# Altium schematic sheet Sheet2.SchDoc
size 558 x 431 mm; SheetNumber: 2; SheetTotal: 2
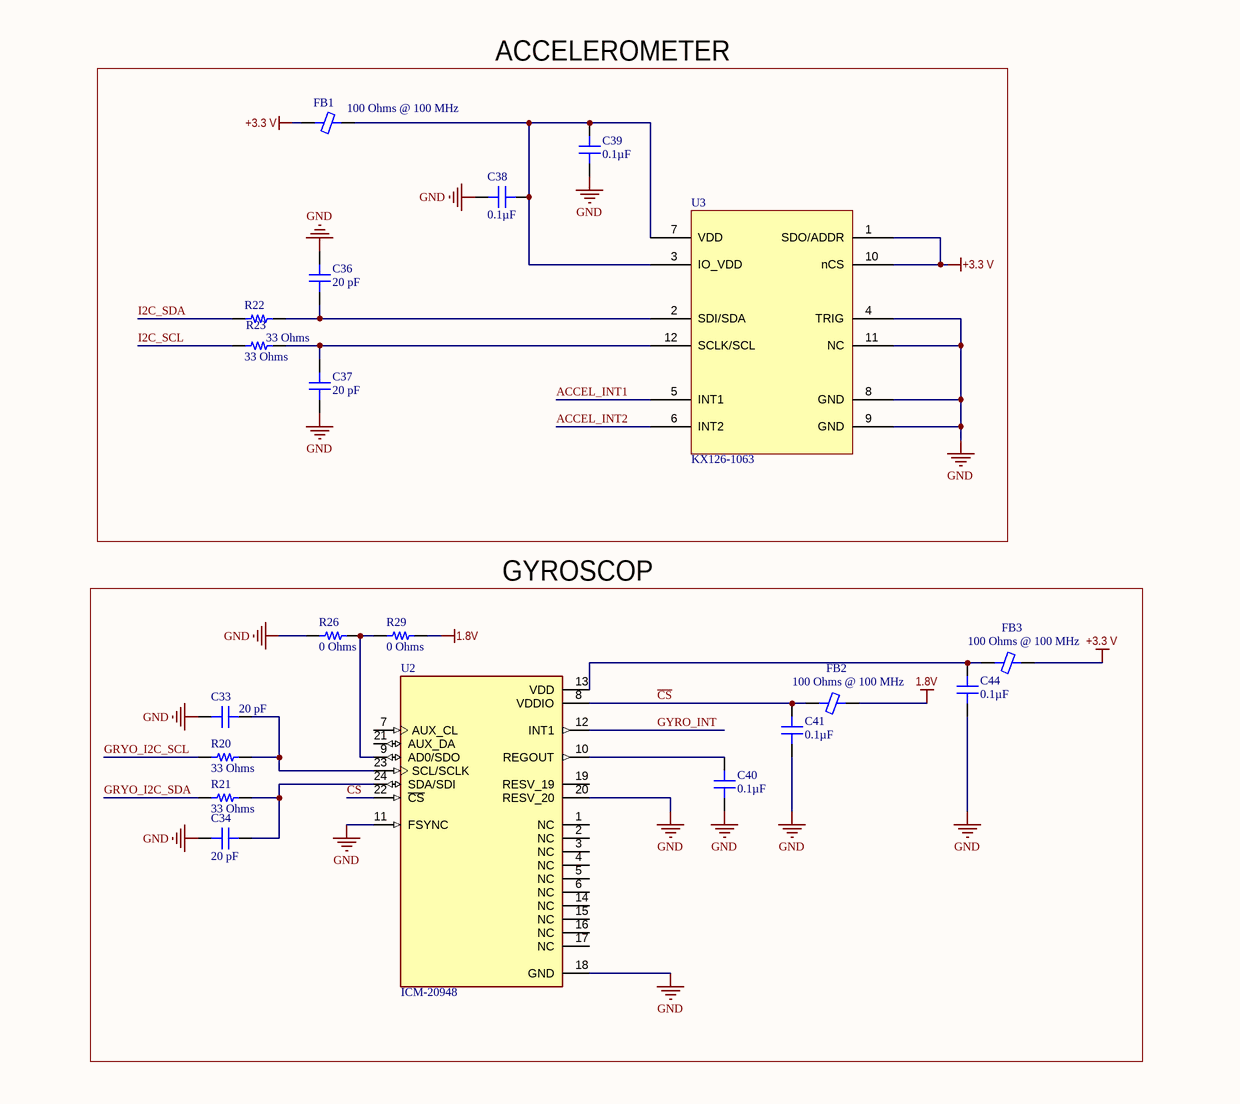
[diagram p0: Sheet2.SchDoc, top left]
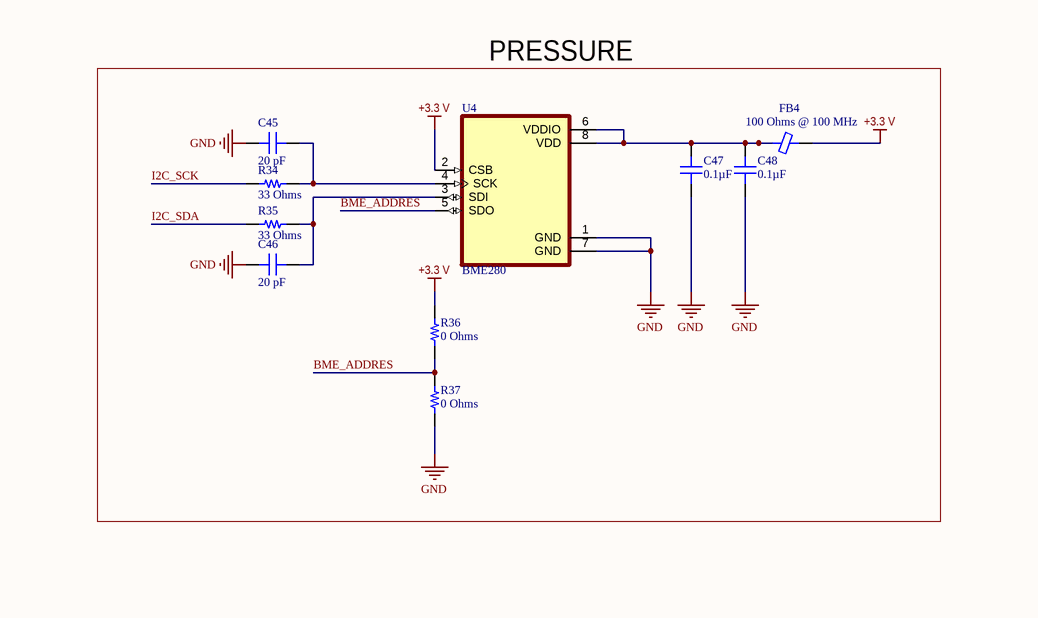
[diagram p1: Sheet2.SchDoc, top right]
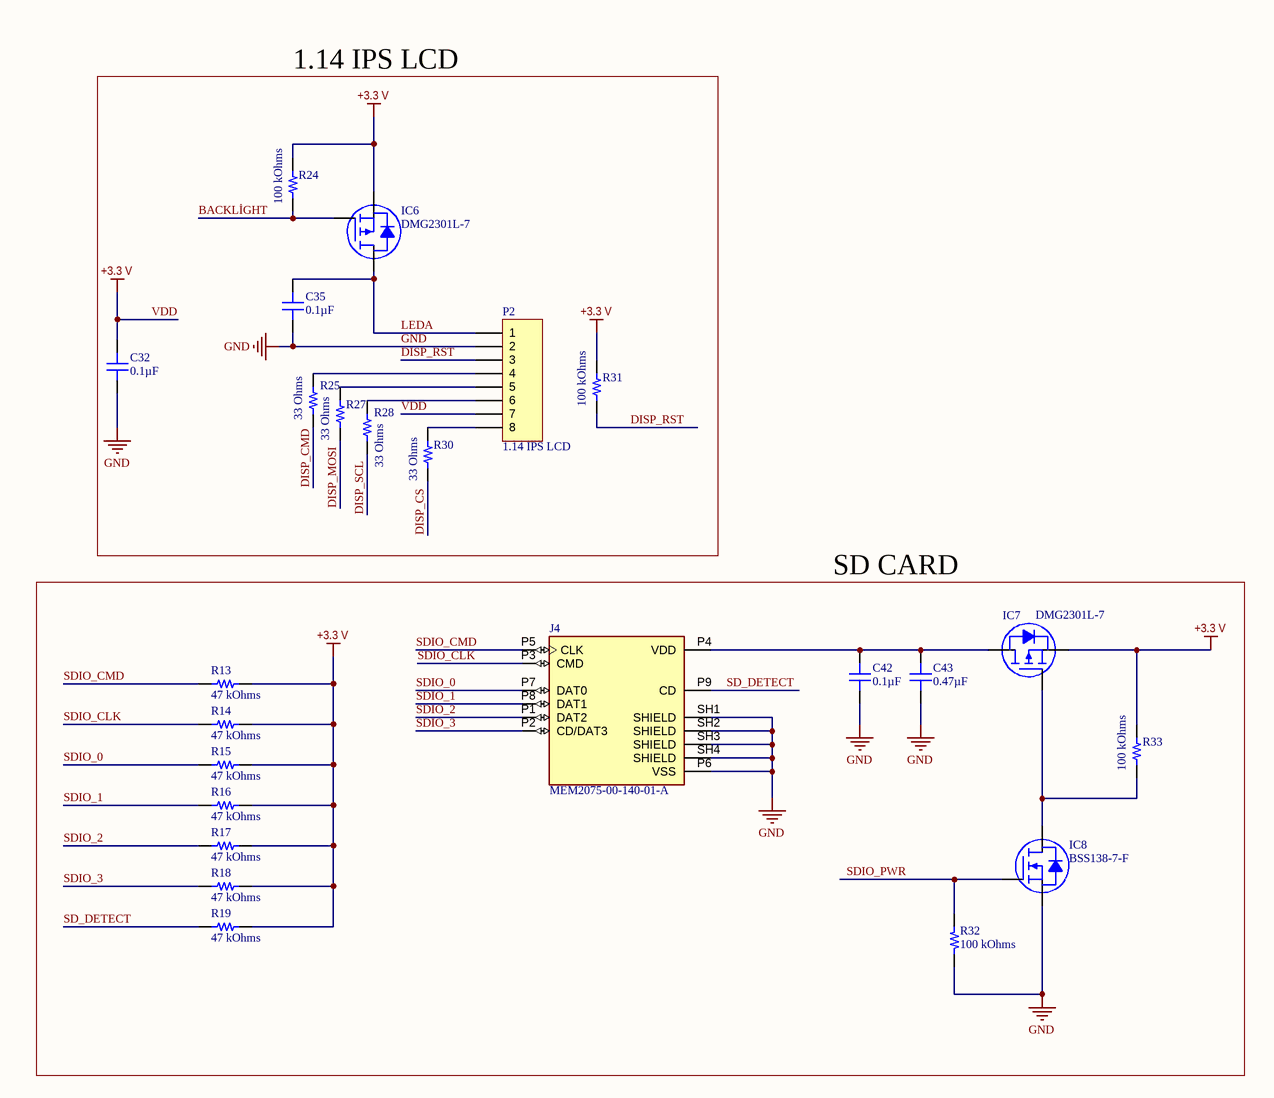
[diagram p2: Sheet2.SchDoc, bottom left]
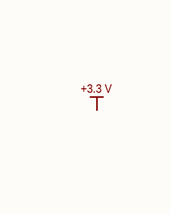
[diagram p3: Sheet2.SchDoc, bottom right]

## Parts
C32  0.1µF  [CAP 0603_1608]
C33  20 pF  [CAP 0603_1608]
C34  20 pF  [CAP 0603_1608]
C35  0.1µF  [CAP 0603_1608]
C36  20 pF  [CAP 0603_1608]
C37  20 pF  [CAP 0603_1608]
C38  0.1µF  [CAP 0603_1608]
C39  0.1µF  [CAP 0603_1608]
C40  0.1µF  [CAP 0603_1608]
C41  0.1µF  [CAP 0603_1608]
C42  0.1µF  [CAP 0603_1608]
C43  0.47µF  [CAP 0603_1608]
C44  0.1µF  [CAP 0603_1608]
C45  20 pF  [CAP 0603_1608]
C46  20 pF  [CAP 0603_1608]
C47  0.1µF  [CAP 0603_1608]
C48  0.1µF  [CAP 0603_1608]
FB1  100 Ohms @ 100 MHz  [FER 0603_1608]
FB2  100 Ohms @ 100 MHz  [FER 0603_1608]
FB3  100 Ohms @ 100 MHz  [FER 0603_1608]
FB4  100 Ohms @ 100 MHz  [FER 0603_1608]
IC6  DMG2301L-7  [DIODES SOT-23-3]
IC7  DMG2301L-7  [DIODES SOT-23-3]
IC8  BSS138-7-F  [DIODES SOT-23-3]
J4  MEM2075-00-140-01-A  [GCT_MEM2075-00-140-01-A]
P2  1.14 IPS LCD  [HIROSE_FH52-8S-0.5SH(99)]
R13  47 kOhms  [RES 0603_1608]
R14  47 kOhms  [RES 0603_1608]
R15  47 kOhms  [RES 0603_1608]
R16  47 kOhms  [RES 0603_1608]
R17  47 kOhms  [RES 0603_1608]
R18  47 kOhms  [RES 0603_1608]
R19  47 kOhms  [RES 0603_1608]
R20  33 Ohms  [RES 0603_1608]
R21  33 Ohms  [RES 0603_1608]
R22  33 Ohms  [RES 0603_1608]
R23  33 Ohms  [RES 0603_1608]
R24  100 kOhms  [RES 0603_1608]
R25  33 Ohms  [RES 0603_1608]
R26  0 Ohms  [RES 0603_1608]
R27  33 Ohms  [RES 0603_1608]
R28  33 Ohms  [RES 0603_1608]
R29  0 Ohms  [RES 0603_1608]
R30  33 Ohms  [RES 0603_1608]
R31  100 kOhms  [RES 0603_1608]
R32  100 kOhms  [RES 0603_1608]
R33  100 kOhms  [RES 0603_1608]
R34  33 Ohms  [RES 0603_1608]
R35  33 Ohms  [RES 0603_1608]
R36  0 Ohms  [RES 0603_1608]
R37  0 Ohms  [RES 0603_1608]
U2  ICM-20948  [QFN40P300X300X105-24N]
U3  KX126-1063  [KIONIX_KXTJ3-1057]
U4  BME280  [PSON65P250X250X100-8N]

## Blocks framed on the sheet
ACCELEROMETER: C36-C39 FB1 R22 R23 U3
PRESSURE: C45-C48 FB4 R34-R37 U4
GYROSCOP: C33 C34 C40 C41 C44 FB2 FB3 R20 R21 R26 R29 U2
1.14 IPS LCD: C32 C35 IC6 P2 R24 R25 R27 R28 R30 R31
SD CARD: C42 C43 IC7 IC8 J4 R13-R19 R32 R33

## Nets
1.8V: FB2.2 R29.2
GND: C32.1 C33.1 C34.2 C35.1 C36.1 C37.2 C38.2 C39.1 C40.1 C41.1 C42.1 C43.1 C44.1 C45.1 C46.2 C47.1 C48.1 IC8.2(S) J4.P6(VSS) J4.SH1(SHIELD) J4.SH2(SHIELD) J4.SH3(SHIELD) J4.SH4(SHIELD) P2.2 R26.1 R32.1 R37.1 U2.11(FSYNC) U2.18(GND) U2.20(RESV_20) U3.4(TRIG) U3.8(GND) U3.9(GND) U3.11(NC) U4.1(GND) U4.7(GND)
VDD: C32.2 FB1.2 FB3.2 FB4.2 IC6.2(S) IC7.2(S) P2.7 R13.2 R14.2 R15.2 R16.2 R17.2 R18.2 R19.2 R24.2 R31.2 R33.2 R36.2 U3.1(SDO/ADDR) U3.10(nCS) U4.2(CSB)  [also labelled +3.3 V]
ACCEL_INT1: U3.5(INT1)
ACCEL_INT2: U3.6(INT2)
BACKLİGHT: IC6.1(G) R24.1
BME_ADDRES: R36.1 R37.2 U4.5(SDO)
~{CS}: C41.2 FB2.1 U2.8(VDDIO) U2.22(~{CS})
DISP_CMD: R25.2
DISP_CS: R30.1
DISP_MOSI: R27.1
DISP_RST: P2.3 R31.1
DISP_SCL: R28.1
GRYO_I2C_SCL: R20.1
GRYO_I2C_SDA: R21.1
GYRO_INT: U2.12(INT1)
I2C_SCK: R34.2
I2C_SCL: R23.1
I2C_SDA: R22.1 R35.1
LEDA: C35.2 IC6.3(D) P2.1
SD_DETECT: J4.P9(CD) R19.1
SDIO_0: J4.P7(DAT0) R15.1
SDIO_1: J4.P8(DAT1) R16.1
SDIO_2: J4.P1(DAT2) R17.1
SDIO_3: J4.P2(CD/DAT3) R18.1
SDIO_CLK: J4.P3(CMD) R14.1
SDIO_CMD: J4.P5(CLK) R13.1
SDIO_PWR: IC8.1(G) R32.2
NetC33_2: C33.2 R20.2 U2.23(SCL/SCLK)
NetC34_1: C34.1 R21.2 U2.24(SDA/SDI)
NetC36_2: C36.2 R22.2 U3.2(SDI/SDA)
NetC37_1: C37.1 R23.2 U3.12(SCLK/SCL)
NetC38_1: C38.1 C39.2 FB1.1 U3.3(IO_VDD) U3.7(VDD)
NetC40_2: C40.2 U2.10(REGOUT)
NetC42_2: C42.2 C43.2 IC7.3(D) J4.P4(VDD)
NetC44_2: C44.2 FB3.1 U2.13(VDD)
NetC45_2: C45.2 R34.1 U4.4(SCK)
NetC46_1: C46.1 R35.2 U4.3(SDI)
NetC47_2: C47.2 C48.2 FB4.1 U4.6(VDDIO) U4.8(VDD)
NetIC7_1: IC7.1(G) IC8.3(D) R33.1
NetP2_4: P2.4 R25.1
NetP2_5: P2.5 R27.2
NetP2_6: P2.6 R28.2
NetP2_8: P2.8 R30.2
NetR26_2: R26.2 R29.1 U2.9(AD0/SDO)

Not connected (* = marked no-connect by the designer): U2 1(NC) 2(NC) 3(NC) 4(NC) 5(NC) 6(NC) 7(AUX_CL) 14(NC) 15(NC) 16(NC) 17(NC) 19(RESV_19) 21(AUX_DA)

## Notes on the sheet
- Labels drawn without touching a wire or pin: +3.3 V
- DWG. NO.
- REV.
- SHT.
- REVISION
- DESCRIPTION
- DATE
- APPROVED
- THIS DOCUMENT AND THE DATA DISCLOSED HEREIN OR HEREWITH IS THE PROPERTY OF ALTIUM LIMITED AND MAY BE FREELY DISTRIBUTED IN WHOLE. NO RIGHTS ARE RESERVED OR EXPRESS OR IMPLIED WARANTEE GIVEN.
- ENG:
- DSN:
- APPROVALS
- PROJECT
- DOCUMENT REVISION:
- DESIGN ITEM:
- CHK:
- BOM:
- REFERENCE DOCUMENTS
- PROJECT REVISION:
- TITLE
- FAB DWG:
- PCB DWG:
- ASSY DWG:
- SCALE:
- SIZE
- C
- CAGE CODE
- FILE NAME
- DWG NO.
- SHEET
- OF
- REV

## Library data of the parts
C32 C35 C38-C42 C44 C47 C48 = 0603YD104KAT2A: CAP CER 0.1UF 16V X5R 0603; manufacturer: AVX Corporation; Tolerance: ±10%; Part Number: 0603YD104KAT2A; Value: 0.1µF; Applications: General Purpose; Capacitance: 0.1µF; componentlink1description: Datasheet; componentlink1url: http://datasheets.avx.com/cx5r.pdf; componentlink2description: DigiKey Link; componentlink2url: http://digikey.com/product-detail/en/avx-corporation/0603YD104KAT2A/478-0603YD104KAT2ACT-ND/11570385; Device Package: 0603 (1608 Metric); lastupdated: 2.09.2020 01:02:55; Lifecycle Status: Active; Minimum Order: 1; Mounting Type: Surface Mount, MLCC; Operating Temperature: -55°C ~ 85°C; Package / Case: 0603 (1608 Metric); packaging: TapeAndReel; partid: 27394; Part Status: Active; price: 0.05; series: -; Supplier 1: DigiKey; Supplier Part Number 1: 478-0603YD104KAT2ACT-ND; Temperature Coefficient: X5R; Voltage - Rated: 16V
C33 C34 C36 C37 C45 C46 = C0603C200C3GAC7867: CAP CER 20PF 25V NP0 0603; manufacturer: KEMET; Temperature Coefficient: C0G, NP0; Tolerance: ±0.25pF; Part Number: C0603C200C3GAC7867; Value: 20 pF; Applications: General Purpose; Capacitance: 20 pF; componentlink1description: Datasheet; componentlink1url: https://api.kemet.com/component-edge/download/datasheet/C0603C200C3GACTU.pdf; componentlink2description: DigiKey Link; componentlink2url: https://www.digikey.com/en/products/detail/kemet/C0603C200C3GAC7867/2200134; Device Package: 0603 (1608 Metric); Features: Low ESL; lastupdated: 14.08.2022 21:09:36; Lifecycle Status: Active; Minimum Order: 1; Mounting Type: Surface Mount, MLCC; Operating Temperature: -55°C ~ 125°C; Package / Case: 0603 (1608 Metric); packaging: TapeAndReel; partid: 6454; Part Status: Active; price: 0.30; series: SMD Comm C0G; Size / Dimension: 0.063" L x 0.031" W (1.60mm x 0.80mm); Supplier 1: DigiKey; Supplier Part Number 1: 399-14496-1-ND; Thickness (Max): 0.034" (0.87mm); Voltage - Rated: 25V
C43 = 0603ZD474KAT2A: CAP CER 0.47UF 10V X5R 0603; manufacturer: AVX Corporation; Tolerance: ±10%; Part Number: 0603ZD474KAT2A; Value: 0.47µF; Applications: General Purpose; Capacitance: 0.47µF; componentlink1description: Datasheet; componentlink1url: http://datasheets.avx.com/cx5r.pdf; componentlink2description: DigiKey Link; componentlink2url: http://digikey.com/product-detail/en/avx-corporation/0603ZD474KAT2A/478-7942-1-ND/3881565; Device Package: 0603 (1608 Metric); lastupdated: 2.09.2020 01:03:34; Lifecycle Status: Active; Minimum Order: 1; Mounting Type: Surface Mount, MLCC; Operating Temperature: -55°C ~ 85°C; Package / Case: 0603 (1608 Metric); packaging: TapeAndReel; partid: 3385; Part Status: Active; price: 0.10; series: -; Size / Dimension: 0.063" L x 0.032" W (1.60mm x 0.81mm); Supplier 1: DigiKey; Supplier Part Number 1: 478-7942-1-ND; Temperature Coefficient: X5R; Thickness (Max): 0.035" (0.90mm); Voltage - Rated: 10V
FB1-FB4 = MH1608-101Y: FERRITE BEAD 100 OHM 0603 1LN; Manufacturer: Bourns Inc.; Current Rating (Max): 3A; DC Resistance (DCR) (Max): 40mOhm; Filter Type: Power, Signal Line; Number of Lines: 1; Part Number: MH1608-101Y; ComponentLink1Description: Datasheet; ComponentLink1URL: https://www.bourns.com/docs/Product-Datasheets/mh.pdf; ComponentLink2Description: DigiKey Link; ComponentLink2URL: https://www.digikey.com/en/products/detail/bourns-inc/MH1608-101Y/2563310; Device Package: 0603 (1608 Metric); Height (Max): 0.039" (1.00mm); Impedance @ Frequency: 100 Ohms @ 100 MHz; LastUpdated: 14.08.2022 21:51:57; Lifecycle Status: Active; Minimum Order: 1; Mounting Type: Surface Mount; Operating Temperature: -55°C ~ 125°C; Package / Case: 0603 (1608 Metric); Packaging: TapeAndReel; PartId: 645; Part Status: Active; Price: 0.02; Series: MH; Size / Dimension: 0.063" L x 0.032" W (1.60mm x 0.80mm); Supplier 1: DigiKey; Supplier Part Number 1: MH1608-101YCT-ND; Value: 100 Ohms @ 100 MHz
IC6 IC7 = DMG2301L-7: MOSFET P-CH 20V 3A SOT23; Part Number: DMG2301L-7
IC8 = BSS138-7-F: MOSFET N-CH 50V 200MA SOT23-3; Part Number: BSS138-7-F
J4 = MEM2075-00-140-01-A: Micro SD Memory Card Connector, 1.4mm Profile SMT, Push-Push, with Normally open Switch; Value: *; MP: MEM2075-00-140-01-A; Package: None; Availability: Unavailable; Price: None
P2 = Header 8: Header, 8-Pin; LatestRevisionDate: 17-Jul-2002; LatestRevisionNote: Re-released for DXP Platform.; Publisher: Altium Limited
R13-R19 = CRGCQ0603J47K: RES 47K OHM 5% 1/10W 0603; Manufacturer: TE Connectivity Passive Product; Power (Watts): 0.1W, 1/10W; Temperature Coefficient: ±100ppm/°C; Part Number: CRGCQ0603J47K; Value: 47 kOhms; ComponentLink1Description: Datasheet; ComponentLink1URL: https://www.te.com/commerce/DocumentDelivery/DDEController?Action=srchrtrv&DocNm=1773204-3&DocType=DS&DocLang=English; ComponentLink2Description: DigiKey Link; ComponentLink2URL: https://www.digikey.com/en/products/detail/te-connectivity-passive-product/CRGCQ0603J47K/8576703; Composition: Thick Film; Device Package: 0603 (1608 Metric); Features: Automotive AEC-Q200, Moisture Resistant; Height - Seated (Max): 0.022" (0.55mm); LastUpdated: 14.08.2022 21:30:17; Lifecycle Status: Active; Minimum Order: 1; Number of Terminations: 2; Operating Temperature: -55°C ~ 155°C; Package / Case: 0603 (1608 Metric); Packaging: CutTape; PartId: 25686; Part Status: Active; Price: 0.01; Ratings: AEC-Q200; Resistance: 47 kOhms; Series: CRGCQ; Size / Dimension: 0.063" L x 0.031" W (1.60mm x 0.80mm); Supplier 1: DigiKey; Supplier Part Number 1: A130101CT-ND; Supplier Device Package: 0603; Tolerance: ±5%
R20-R23 R25 R27 R28 R30 R34 R35 = AC0603JR-0733RL: RES SMD 33 OHM 5% 1/10W 0603; Manufacturer: Yageo; Power (Watts): 0.1W, 1/10W; Temperature Coefficient: ±100ppm/°C; Part Number: AC0603JR-0733RL; Value: 33 Ohms; ComponentLink1Description: Datasheet; ComponentLink1URL: https://www.yageo.com/upload/media/product/productsearch/datasheet/rchip/PYu-AC_51_RoHS_L_7.pdf; ComponentLink2Description: DigiKey Link; ComponentLink2URL: https://www.digikey.com/en/products/detail/yageo/AC0603JR-0733RL/5896437; Composition: Thick Film; Device Package: 0603 (1608 Metric); Features: Automotive AEC-Q200, Moisture Resistant; Height - Seated (Max): 0.022" (0.55mm); LastUpdated: 14.08.2022 21:30:39; Lifecycle Status: Active; Minimum Order: 1; Number of Terminations: 2; Operating Temperature: -55°C ~ 155°C; Package / Case: 0603 (1608 Metric); Packaging: CutTape; PartId: 22917; Part Status: Active; Price: 0.01; Ratings: AEC-Q200; Resistance: 33 Ohms; Series: AC; Size / Dimension: 0.063" L x 0.031" W (1.60mm x 0.80mm); Supplier 1: DigiKey; Supplier Part Number 1: YAG3666CT-ND; Supplier Device Package: 0603; Tolerance: ±5%
R24 R31-R33 = CRCW0603100KJNEA: RES SMD 100K OHM 5% 1/10W 0603; Manufacturer: Vishay Dale; Power (Watts): 0.1W, 1/10W; Temperature Coefficient: ±200ppm/°C; Part Number: CRCW0603100KJNEA; Value: 100 kOhms; ComponentLink1Description: Datasheet; ComponentLink1URL: http://www.vishay.com/docs/20035/dcrcwe3.pdf; ComponentLink2Description: DigiKey Link; ComponentLink2URL: https://www.digikey.com/en/products/detail/vishay-dale/CRCW0603100KJNEA/1174277; Composition: Thick Film; Device Package: 0603 (1608 Metric); Features: Automotive AEC-Q200; Height - Seated (Max): 0.020" (0.50mm); LastUpdated: 14.08.2022 21:30:46; Lifecycle Status: Active; Minimum Order: 1; Number of Terminations: 2; Operating Temperature: -55°C ~ 155°C; Package / Case: 0603 (1608 Metric); Packaging: CutTape; PartId: 21189; Part Status: Active; Price: 0.01; Ratings: AEC-Q200; Resistance: 100 kOhms; Series: CRCW; Size / Dimension: 0.063" L x 0.033" W (1.60mm x 0.85mm); Supplier 1: DigiKey; Supplier Part Number 1: 541-100KGCT-ND; Supplier Device Package: 0603; Tolerance: ±5%
R26 R29 R36 R37 = 5111: RES 0 OHM JUMPER 0603; Part Number: 5111; Manufacturer: Keystone Electronics; Power (Watts): 0.5W, 1/2W; Value: 0 Ohms; ComponentLink1Description: Datasheet; ComponentLink1URL: http://www.keyelco.com/product-pdf.cfm?p=14349; ComponentLink2Description: DigiKey Link; ComponentLink2URL: https://www.digikey.com/en/products/detail/keystone-electronics/5111/7942980; Composition: Metal Element; Device Package: 0603 (1608 Metric); Height - Seated (Max): 0.033" (0.84mm); LastUpdated: 14.08.2022 21:30:44; Lifecycle Status: Active; Minimum Order: 1; Number of Terminations: 2; Package / Case: 0603 (1608 Metric); Packaging: TapeAndReel; PartId: 21630; Part Status: Active; Price: 0.16; Resistance: 0 Ohms; Series: -; Size / Dimension: 0.061" L x 0.033" W (1.55mm x 0.85mm); Supplier 1: DigiKey; Supplier Part Number 1: 36-5111CT-ND; Supplier Device Package: 0603; Tolerance: Jumper
U2 = ICM-20948: Accelerometer, Gyroscope, Magnetometer, 9 Axis Sensor IÂ²C, SPI Output; Value: *; Availability: Unavailable; Price: None; Package: None; MP: ICM-20948
U4 = BME280: DIGITAL HUMIDITY, PRESSURE AND TEMPERATURE SENSOR<br>* Digital interface IÂ²C (up to 3.4 MHz) and SPI (3 and 4 wire, up to 10 MHz)* Supply voltage VDD main supply voltage range: 1.71 V to 3.6 V*VDDIO interface voltage range: 1.2 V to 3.6 V<br> Operating range -40â€¦+85 Â°C, 0â€¦100 % rel. humidity, 300â€¦1100 hPa <br><br>  The library has been designed by<a href="https://www.facebook.com/groups/eaglecadsoftUK"> Richard Magdycz</a>; Price: None; MP: BME280; Value: *; Availability: Unavailable; Package: None